# Altium schematic sheet MCU.SchDoc
size A4
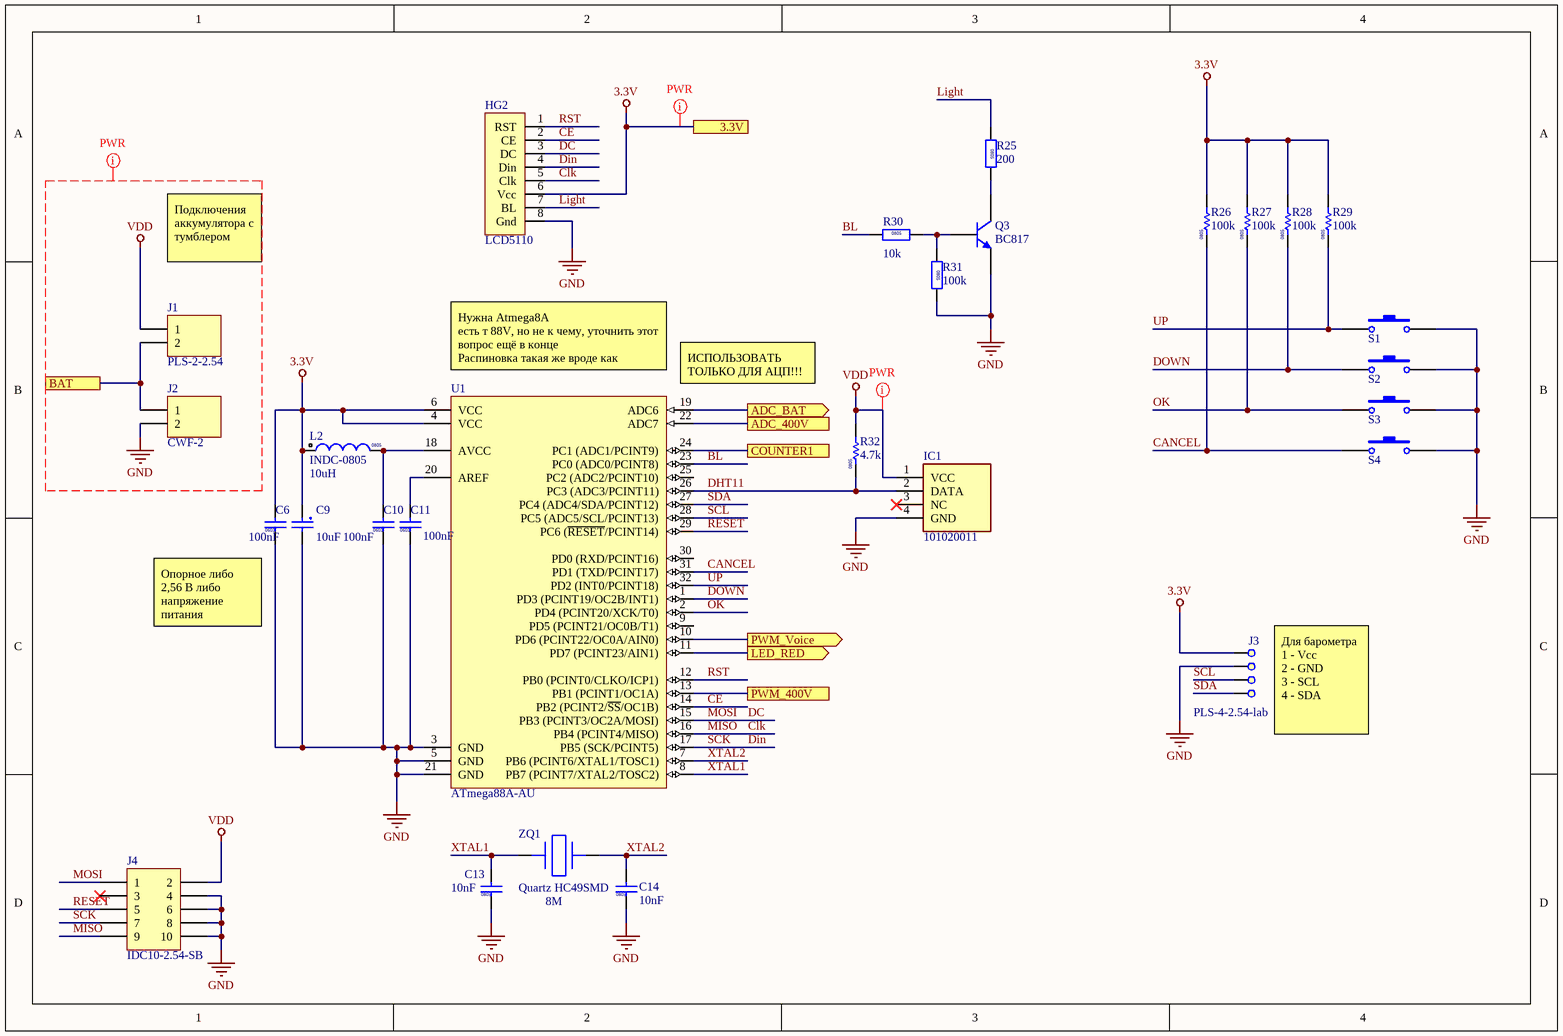
[diagram p0: MCU.SchDoc]

## Parts
C6  value 100nF  [CAPC1608-0603L]  (hidden comment: CAPC_0603)
C9  value 10uF  [TCAPC_A]  (hidden comment: TCAPC_A)
C10  value 100nF  [CAPC1608-0603L]  (hidden comment: CAPC_0603)
C11  value 100nF  [CAPC1608-0603L]  (hidden comment: CAPC_0603)
C13  value 10nF  [CAPC2012-0805M]  (hidden comment: CAPC_0805)
C14  value 10nF  [CAPC2012-0805M]  (hidden comment: CAPC_0805)
HG2  LCD5110  [LCD]
IC1  101020011  [HDRV4W80P0X254_1X4_1200X500X1550P]
J1  PLS-2-2.54  [PLS-2-2.54]
J2  CWF-2  [CWF-2]
J3  PLS-4-2.54-lab  [PLS-4-2.54-lab]
J4  IDC10-2.54-SB  [IDC10-2.54-SB]
L2  INDC-0805  value 10uH  [INDC2012L]
Q3  BC817  [SOT23-3M]
R25  value 200  [RESC2012-0805M]  (hidden comment: RESC_0805_R)
R26  value 100k  [RESC2012-0805M]  (hidden comment: RESC_0805)
R27  value 100k  [RESC2012-0805M]  (hidden comment: RESC_0805)
R28  value 100k  [RESC2012-0805M]  (hidden comment: RESC_0805)
R29  value 100k  [RESC2012-0805M]  (hidden comment: RESC_0805)
R30  value 10k  [RESC2012-0805M]  (hidden comment: RESC_0805_R)
R31  value 100k  [RESC2012-0805M]  (hidden comment: RESC_0805_R)
R32  value 4.7k  [RESC2012-0805M]  (hidden comment: RESC_0805)
S1  Switch  [Switch]  (value not drawn)
S2  Switch  [Switch]  (value not drawn)
S3  Switch  [Switch]  (value not drawn)
S4  Switch  [Switch]  (value not drawn)
U1  ATmega88A-AU  [32A_L]
ZQ1  Quartz HC49SMD  value 8M  [HC-49SMD]

## Ports
3.3V, ADC_400V, ADC_BAT (out), BAT, COUNTER1, LED_RED (out), PWM_400V, PWM_Voice (out)

## Nets
3.3V: C6.2 C9.1 HG2.6(Vcc) J3.1 L2.1 R26.2 R27.2 R28.2 R29.2 U1.4(VCC) U1.6(VCC) ; port 3.3V
GND: C6.1 C9.2 C10.1 C11.1 C13.1 C14.1 HG2.8(Gnd) IC1.4(GND) J2.2 J3.2 J4.4 J4.6 J4.8 J4.10 Q3.2(E) R31.2 S1.2 S2.2 S3.2 S4.2 U1.3(GND) U1.5(GND) U1.21(GND)
VDD: IC1.1(VCC) J1.1 J4.2 R32.2
ADC_400V: U1.22(ADC7) ; port ADC_400V
ADC_BAT: U1.19(ADC6) ; port ADC_BAT
BAT: J1.2 J2.1 ; port BAT
BL: R30.1 U1.23(PC0_(ADC0/PCINT8))
CANCEL: R26.1 S4.1 U1.31(PD1_(TXD/PCINT17))
CE: HG2.2(CE) U1.14(PB2_(PCINT2/~{SS}/OC1B))
Clk: HG2.5(Clk) J4.9 U1.16(PB4_(PCINT4/MISO))  [also labelled MISO]
COUNTER1: U1.24(PC1_(ADC1/PCINT9)) ; port COUNTER1
DC: HG2.3(DC) J4.1 U1.15(PB3_(PCINT3/OC2A/MOSI))  [also labelled MOSI]
DHT11: IC1.2(DATA) R32.1 U1.26(PC3_(ADC3/PCINT11))
Din: HG2.4(Din) J4.7 U1.17(PB5_(SCK/PCINT5))  [also labelled SCK]
DOWN: R28.1 S2.1 U1.1(PD3_(PCINT19/OC2B/INT1))
LED_RED: U1.11(PD7_(PCINT23/AIN1)) ; port LED_RED
Light: HG2.7(BL) R25.1
OK: R27.1 S3.1 U1.2(PD4_(PCINT20/XCK/T0))
PWM_400V: U1.13(PB1_(PCINT1/OC1A)) ; port PWM_400V
PWM_Voice: U1.10(PD6_(PCINT22/OC0A/AIN0)) ; port PWM_Voice
RESET: J4.5 U1.29(PC6_(~{RESET}/PCINT14))
RST: HG2.1(RST) U1.12(PB0_(PCINT0/CLKO/ICP1))
SCL: J3.3 U1.28(PC5_(ADC5/SCL/PCINT13))
SDA: J3.4 U1.27(PC4_(ADC4/SDA/PCINT12))
UP: R29.1 S1.1 U1.32(PD2_(INT0/PCINT18))
XTAL1: C13.2 U1.8(PB7_(PCINT7/XTAL2/TOSC2)) ZQ1.1
XTAL2: C14.2 U1.7(PB6_(PCINT6/XTAL1/TOSC1)) ZQ1.2
NetC10_2: C10.2 L2.2 U1.18(AVCC)
NetC11_2: C11.2 U1.20(AREF)
NetQ3_1: Q3.1(B) R30.2 R31.1
NetQ3_3: Q3.3(C) R25.2

Not connected (* = marked no-connect by the designer): IC1 3(NC)*; J4 3*; U1 9(PD5_(PCINT21/OC0B/T1)) 25(PC2_(ADC2/PCINT10)) 30(PD0_(RXD/PCINT16))

## Layout directives
mark named PWR: 3.3V, GND, VDD

## Notes on the sheet
- Подключения аккумулятора с тумблером
- (near U1) Нужна Atmega8A
  есть т 88V, но не к чему, уточнить этот вопрос ещё в конце
  Распиновка такая же вроде как
- (near U1) ИСПОЛЬЗОВАТЬ ТОЛЬКО ДЛЯ АЦП!!!
- Опорное либо 2,56 В либо напряжение питания
- (near J3) Для барометра
  1 - Vcc
  2 - GND
  3 - SCL
  4 - SDA
- (in symbol CAPC_0603) 0603
- (in symbol CAPC_0805) 0805
- (in symbol INDC-0805) 0805
- (in symbol RESC_0805) 0805
- (in symbol RESC_0805_R) 0805

## Library data of the parts
C6 C10 C11 = CAPC_0603: Capacitor 0603
C9 = TCAPC_A: Capacitor tantalum SMD type A
C13 C14 = CAPC_0805: Capacitor 0805
HG2 = LCD5110: Дисплей Nokia 5110 84x48
IC1 = 101020011: Integrated Circuit; Manufacturer_Name: Seeed Studio; Datasheet Link: https://componentsearchengine.com/Datasheets/1/101020011.pdf; Height: 15.5mm; Manufacturer_Part_Number: 101020011; Mouser Part Number: 713-101020011; Mouser Price/Stock: https://www.mouser.com/Search/Refine.aspx?Keyword=713-101020011; RS Part Number: 1743237; RS Price/Stock: http://uk.rs-online.com/web/p/products/1743237
J4 = IDC10-2.54-SB: IDC10 2.54 mm pitch Straight, plastic Box; LatestRevisionDate: 17-Jul-2002; LatestRevisionNote: Re-released for DXP Platform.; Publisher: Altium Limited
L2 = INDC-0805: Chip Inductor, Body Body 2.0x1.2mm
Q3 = BC817: BC817 NPN Transistor
R25 R30 R31 = RESC_0805_R: Resistor 0805
R26-R29 R32 = RESC_0805: Resistor 0805
U1 = ATmega88A-AU: 8-bit AVR Microcontroller, 8KB Flash, 512 Bytes EEPROM, 1KB SRAM, 32-pin TQFP, Industrial Grade (-40°C to 85°C); Published: 1-Apr-2010; DatasheetVersion: revA, Jan-2010; PackageVersion: revB, Oct-2001; PackageReference: 32A; Publisher: Altium Limited; PackageDescription: 32-Lead, 7x7x1.0 mm Body, 0.8mm Lead Pitch, Thin Profile Plastic Quad Flat Package (TQFP); Supplier 1: Digi-Key; Supplier Part Number 1: ATMEGA88A-AU-ND; Supplier 2: Mouser; Supplier Part Number 2: 556-ATMEGA88A-AU; Code_JEDEC: MS-026-ABA; ComponentLink1Description: Manufacturer Link; ComponentLink1URL: http://www.atmel.com/products/avr/default.asp?; ComponentLink2Description: ATmega48A/48PA/88A/88PA/168A/168PA/328/328P Datasheet; ComponentLink2URL: http://www.atmel.com/dyn/resources/prod_documents/8271.pdf; ComponentLink3Description: ATmega48A/48PA/88A/88PA/168A/168PA/328/328P Summary; ComponentLink3URL: http://www.atmel.com/dyn/resources/prod_documents/8271S.pdf; ComponentLink4Description: Atmel.com Home; ComponentLink4URL: http://www.atmel.com
J1 = PLS-2-2.54: LatestRevisionDate: 17-Jul-2002; LatestRevisionNote: Re-released for DXP Platform.; Publisher: Altium Limited
J3 = PLS-4-2.54-lab: LatestRevisionDate: 17-Jul-2002; LatestRevisionNote: Re-released for DXP Platform.; Publisher: Altium Limited
S1-S4 = Switch: Published: 24-Mar-1999; LatestRevisionDate: 17-Jul-2002; LatestRevisionNote: Re-released for DXP Platform.; PackageReference: SPST-2; Publisher: Altium Limited